# Altium schematic sheet BMS_3.SchDoc
size A0
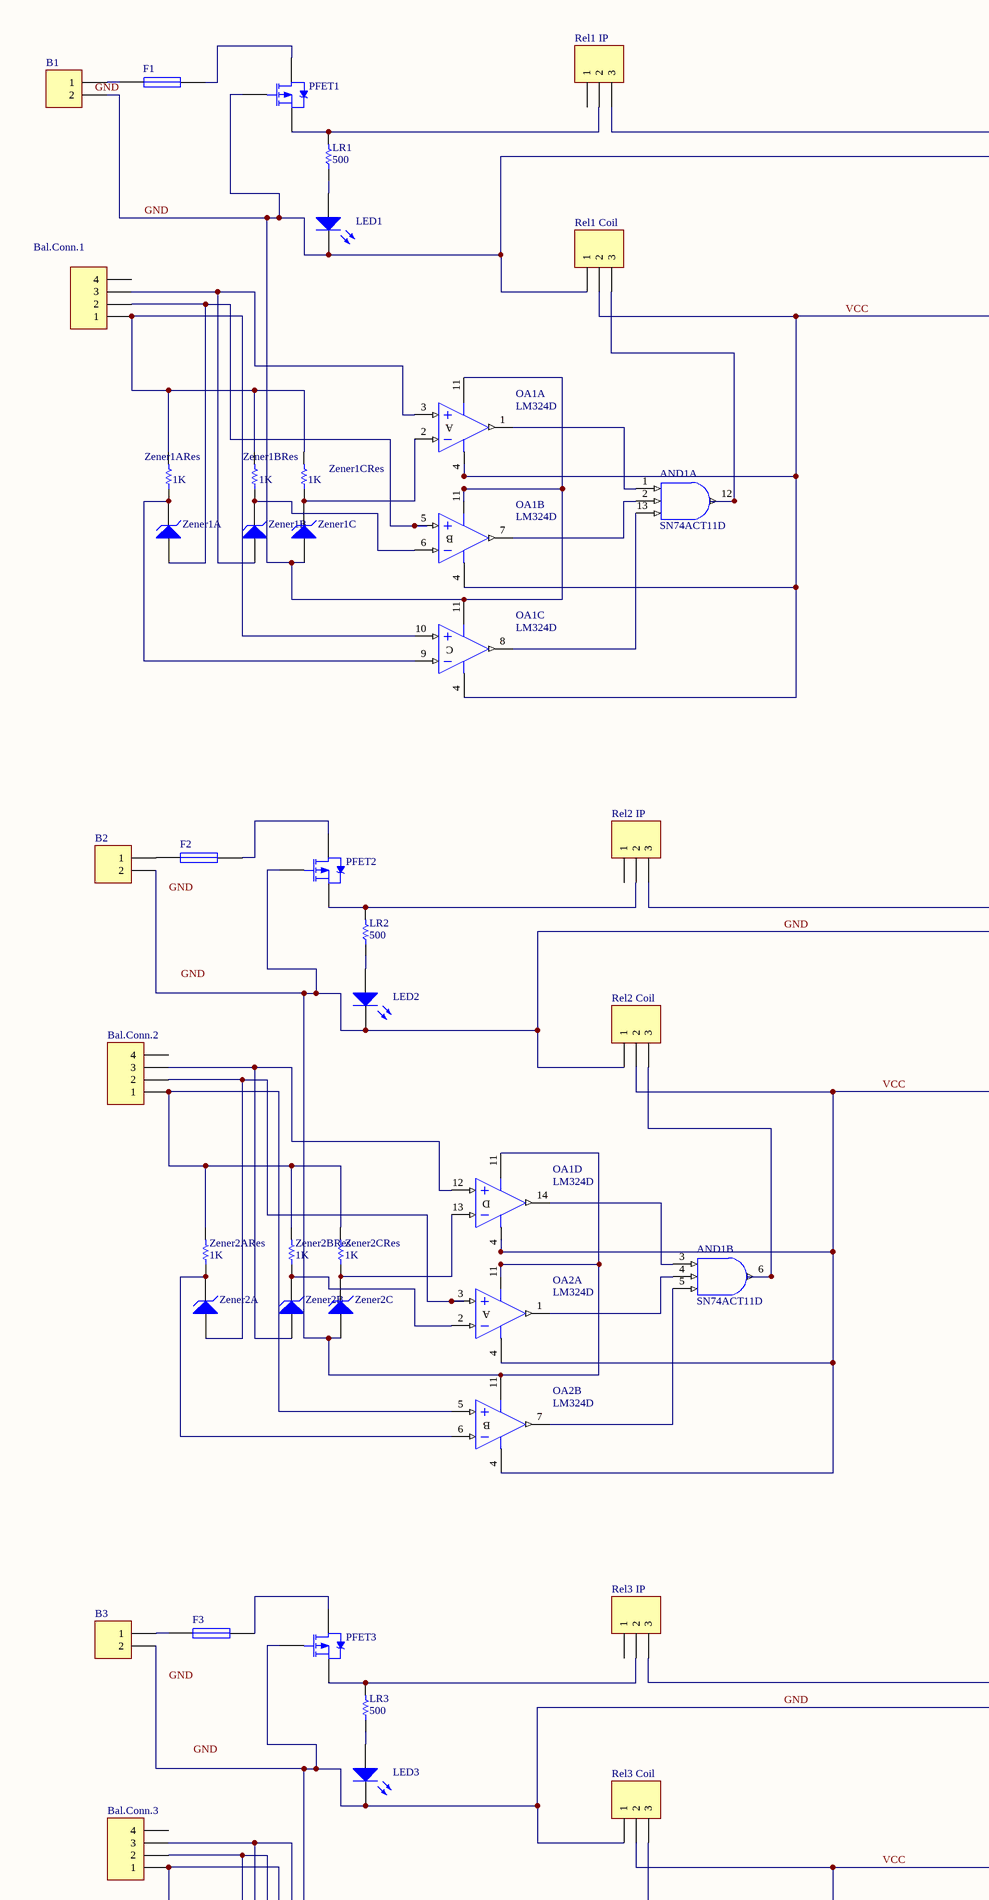
[diagram p0: BMS_3.SchDoc, top left]
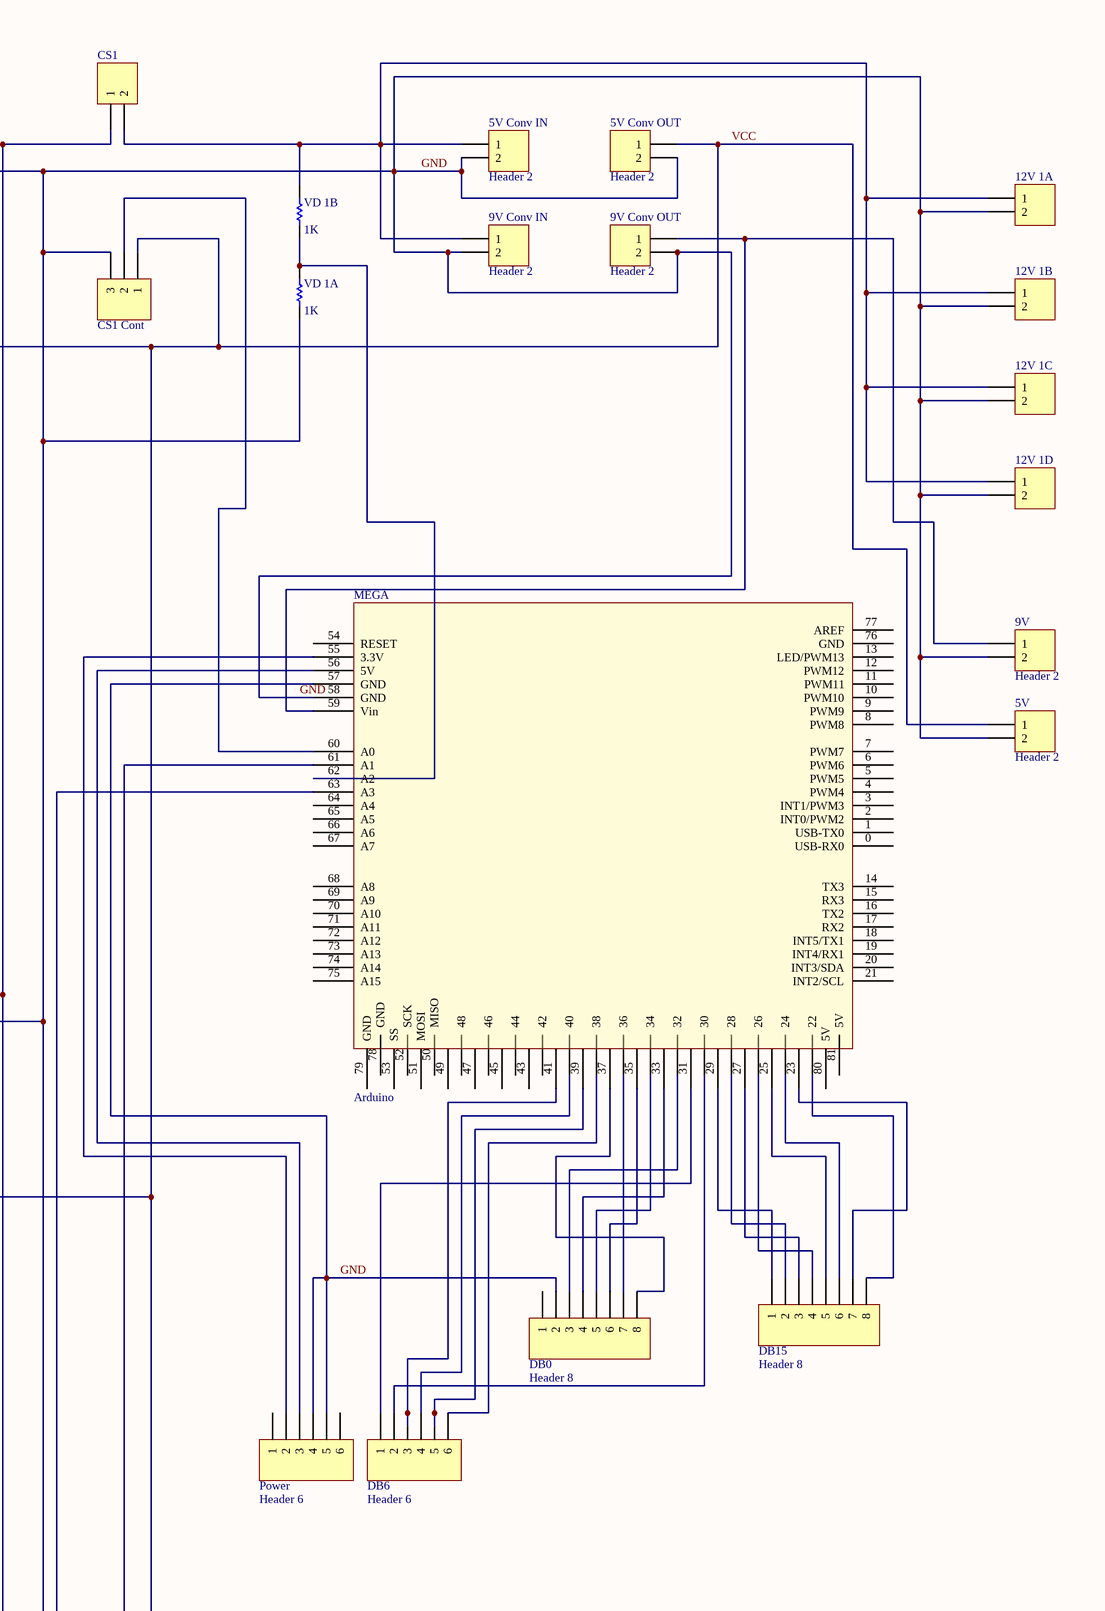
[diagram p1: BMS_3.SchDoc, top right]
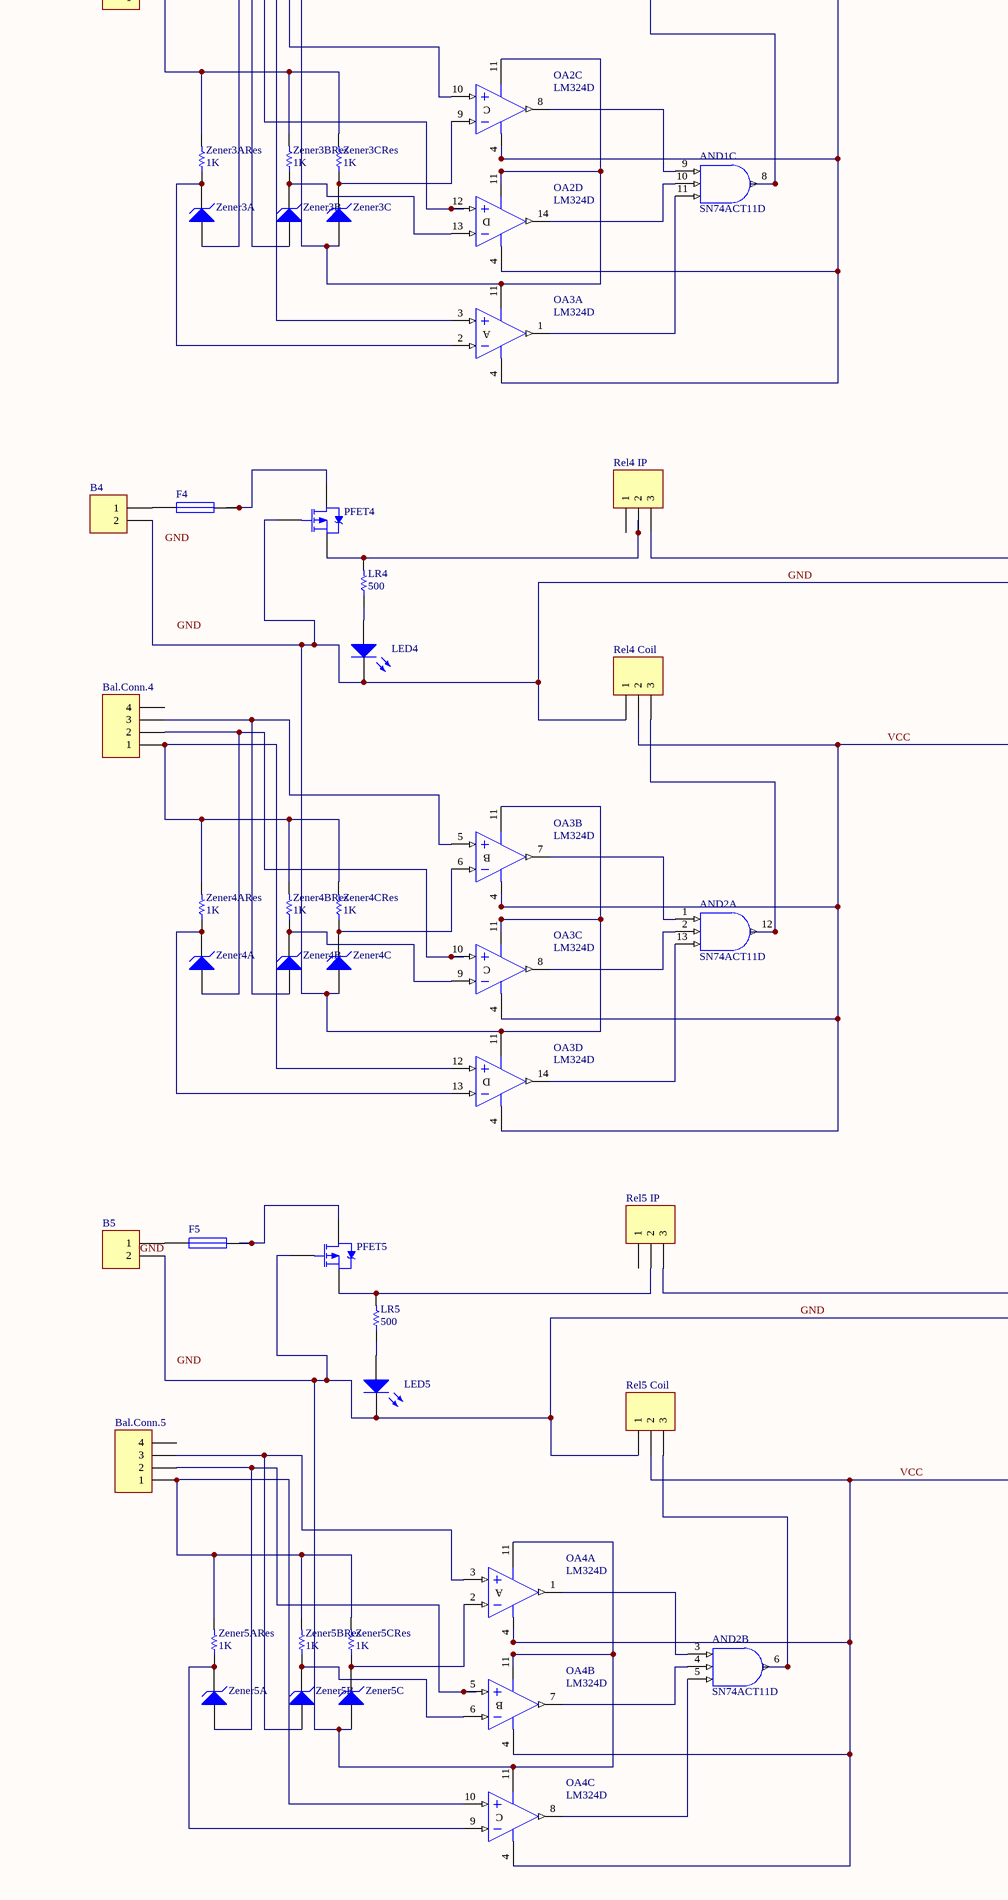
[diagram p2: BMS_3.SchDoc, bottom left]
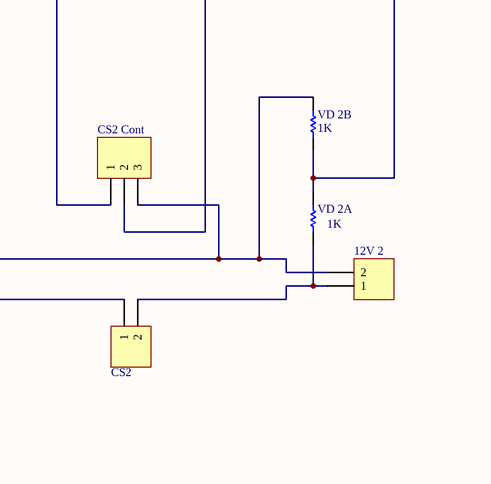
[diagram p3: BMS_3.SchDoc, bottom right]

## Parts
5V  Header 2  [HDR1X2]
5V_Conv_IN  Header 2  [HDR1X2]
5V_Conv_OUT  Header 2  [HDR1X2]
9V  Header 2  [HDR1X2]
9V_Conv_IN  Header 2  [HDR1X2]
9V_Conv_OUT  Header 2  [HDR1X2]
12V_1A  Header 2  [HDR1X2]  (value not drawn)
12V_1B  Header 2  [HDR1X2]  (value not drawn)
12V_1C  Header 2  [HDR1X2]  (value not drawn)
12V_1D  Header 2  [HDR1X2]  (value not drawn)
12V_2  12V supply  [HDR1X2]  (value not drawn)
AND1  SN74ACT11D  [N014]  (parts A,B,C of 3)
AND2  SN74ACT11D  [N014]  (parts A,B of 3)
B1  Header 2  [HDR1X2]  (value not drawn)
B2  Battery  [HDR1X2]  (value not drawn)
B3  Battery  [HDR1X2]  (value not drawn)
B4  Battery  [HDR1X2]  (value not drawn)
B5  Battery  [HDR1X2]  (value not drawn)
Bal.Conn.1  Balance Connector  [HDR1X4H]  (value not drawn)
Bal.Conn.2  Balance Connector  [HDR1X4H]  (value not drawn)
Bal.Conn.3  Balance Connector  [HDR1X4H]  (value not drawn)
Bal.Conn.4  Balance Connector  [HDR1X4H]  (value not drawn)
Bal.Conn.5  Balance Connector  [HDR1X4H]  (value not drawn)
CS1  Header 2  [HDR1X2]  (value not drawn)
CS1_Cont  Header 3H  [HDR1X3H]  (value not drawn)
CS2  Header 2  [HDR1X2]  (value not drawn)
CS2_Cont  Header 3H  [HDR1X3H]  (value not drawn)
DB0  Header 8  [HDR1X8]
DB6  Header 6  [HDR1X6]
DB15  Header 8  [HDR1X8]
F1  Fuse  [PIN-W2/E2.8]  (value not drawn)
F2  Fuse  [PIN-W2/E2.8]  (value not drawn)
F3  Fuse  [PIN-W2/E2.8]  (value not drawn)
F4  Fuse  [PIN-W2/E2.8]  (value not drawn)
F5  Fuse5  [PIN-W2/E2.8]  (value not drawn)
LED1  LED  [LED-0]  (value not drawn)
LED2  LED  [LED-0]  (value not drawn)
LED3  LED  [LED-0]  (value not drawn)
LED4  LED  [LED-0]  (value not drawn)
LED5  LED  [LED-0]  (value not drawn)
LR1  500  [AXIAL-0.3]
LR2  500  [AXIAL-0.3]
LR3  500  [AXIAL-0.3]
LR4  500  [AXIAL-0.3]
LR5  500  [AXIAL-0.3]
MEGA  Arduino  [Arduino]
OA1  LM324D  [N014]  (parts A,B,C,D of 4)
OA2  LM324D  [N014]  (parts A,B,C,D of 4)
OA3  LM324D  [N014]  (parts A,B,C,D of 4)
OA4  LM324D  [N014]  (parts A,B,C of 4)
PFET1  PMOS  [TO-220AB]  (value not drawn)
PFET2  PMOS  [TO-220AB]  (value not drawn)
PFET3  PMOS  [TO-220AB]  (value not drawn)
PFET4  PMOS  [TO-220AB]  (value not drawn)
PFET5  PMOS  [TO-220AB]  (value not drawn)
Power  Header 6  [HDR1X6]
Rel1_Coil  Relay coil  [HDR1X3H]  (value not drawn)
Rel1_IP  Relay  [HDR1X3H]  (value not drawn)
Rel2_Coil  Relay coil  [HDR1X3H]  (value not drawn)
Rel2_IP  Relay  [HDR1X3H]  (value not drawn)
Rel3_Coil  Relay coil  [HDR1X3H]  (value not drawn)
Rel3_IP  Relay  [HDR1X3H]  (value not drawn)
Rel4_Coil  Relay coil  [HDR1X3H]  (value not drawn)
Rel4_IP  Relay  [HDR1X3H]  (value not drawn)
Rel5_Coil  Relay coil  [HDR1X3H]  (value not drawn)
Rel5_IP  Relay  [HDR1X3H]  (value not drawn)
VD_1A  value 1K  [AXIAL-0.3]  (hidden comment: Res2)
VD_1B  value 1K  [AXIAL-0.3]  (hidden comment: Res1)
VD_2A  value 1K  [AXIAL-0.3]  (hidden comment: Res1)
VD_2B  value 1K  [AXIAL-0.3]  (hidden comment: Res1)
Zener1A  D Zener  [DIODE-0.4]  (value not drawn)
Zener1ARes  1K  [AXIAL-0.3]
Zener1B  D Zener  [DIODE-0.4]  (value not drawn)
Zener1BRes  1K  [AXIAL-0.3]
Zener1C  D Zener  [DIODE-0.4]  (value not drawn)
Zener1CRes  1K  [AXIAL-0.3]
Zener2A  D Zener  [DIODE-0.4]  (value not drawn)
Zener2ARes  1K  [AXIAL-0.3]
Zener2B  D Zener  [DIODE-0.4]  (value not drawn)
Zener2BRes  1K  [AXIAL-0.3]
Zener2C  D Zener  [DIODE-0.4]  (value not drawn)
Zener2CRes  1K  [AXIAL-0.3]
Zener3A  D Zener  [DIODE-0.4]  (value not drawn)
Zener3ARes  1K  [AXIAL-0.3]
Zener3B  D Zener  [DIODE-0.4]  (value not drawn)
Zener3BRes  1K  [AXIAL-0.3]
Zener3C  D Zener  [DIODE-0.4]  (value not drawn)
Zener3CRes  1K  [AXIAL-0.3]
Zener4A  D Zener  [DIODE-0.4]  (value not drawn)
Zener4ARes  1K  [AXIAL-0.3]
Zener4B  D Zener  [DIODE-0.4]  (value not drawn)
Zener4BRes  1K  [AXIAL-0.3]
Zener4C  D Zener  [DIODE-0.4]  (value not drawn)
Zener4CRes  1K  [AXIAL-0.3]
Zener5A  D Zener  [DIODE-0.4]  (value not drawn)
Zener5ARes  1K  [AXIAL-0.3]
Zener5B  D Zener  [DIODE-0.4]  (value not drawn)
Zener5BRes  1K  [AXIAL-0.3]
Zener5C  D Zener  [DIODE-0.4]  (value not drawn)
Zener5CRes  1K  [AXIAL-0.3]

## Nets
GND: 5V.2 5V_Conv_IN.2 5V_Conv_OUT.2 9V.2 9V_Conv_IN.2 9V_Conv_OUT.2 12V_1A.2 12V_1B.2 12V_1C.2 12V_1D.2 12V_2.2 AND1.7(GND) AND2.7(GND) B1.2 B2.2 B3.2 B4.2 B5.2 CS1_Cont.3 CS2_Cont.3 DB0.2 LED1.2(K) LED2.2(K) LED3.2(K) LED4.2(K) LED5.2(K) MEGA.57(GND) MEGA.58(GND) OA1.11(V-) OA2.11(V-) OA3.11(V-) OA4.11(V-) PFET1.1(G) PFET2.1(G) PFET3.1(G) PFET4.1(G) PFET5.1(G) Power.4 Power.5 Rel1_Coil.1 Rel2_Coil.1 Rel3_Coil.1 Rel4_Coil.1 Rel5_Coil.1 VD_1A.1 VD_2B.2 Zener1C.1(A) Zener2C.1(A) Zener3C.1(A) Zener4C.1(A) Zener5C.1(A)
VCC: 5V.1 5V_Conv_OUT.1 AND1.14(VCC) AND2.14(VCC) CS1_Cont.1 CS2_Cont.1 OA1.4(V+) OA2.4(V+) OA3.4(V+) OA4.4(V+) Rel1_Coil.2 Rel2_Coil.2 Rel3_Coil.2 Rel4_Coil.2 Rel5_Coil.2
Net5V_Conv_IN_1: 5V_Conv_IN.1 9V_Conv_IN.1 12V_1A.1 12V_1B.1 12V_1C.1 12V_1D.1 CS1.2 VD_1B.2
Net9V_1: 9V.1 9V_Conv_OUT.1 MEGA.59(Vin)
Net12V_2_1: 12V_2.1 CS2.2 VD_2A.1
NetAND1_1: AND1.1(A) OA1.1(OUT)
NetAND1_2: AND1.2(B) OA1.7(OUT)
NetAND1_3: AND1.3(A) OA1.14(OUT)
NetAND1_4: AND1.4(B) OA2.1(OUT)
NetAND1_5: AND1.5(C) OA2.7(OUT)
NetAND1_6: AND1.6(Y) Rel2_Coil.3
NetAND1_8: AND1.8(Y) Rel3_Coil.3
NetAND1_9: AND1.9(A) OA2.8(OUT)
NetAND1_10: AND1.10(B) OA2.14(OUT)
NetAND1_11: AND1.11(C) OA3.1(OUT)
NetAND1_12: AND1.12(Y) Rel1_Coil.3
NetAND1_13: AND1.13(C) OA1.8(OUT)
NetAND2_1: AND2.1(A) OA3.7(OUT)
NetAND2_2: AND2.2(B) OA3.8(OUT)
NetAND2_3: AND2.3(A) OA4.1(OUT)
NetAND2_4: AND2.4(B) OA4.7(OUT)
NetAND2_5: AND2.5(C) OA4.8(OUT)
NetAND2_6: AND2.6(Y) Rel5_Coil.3
NetAND2_12: AND2.12(Y) Rel4_Coil.3
NetAND2_13: AND2.13(C) OA3.14(OUT)
NetB1_1: B1.1 F1.2
NetB2_1: B2.1 F2.2
NetB3_1: B3.1 F3.2
NetB4_1: B4.1 F4.2
NetB5_1: B5.1 F5.2
NetBal.Conn.1_1: Bal.Conn.1.1 OA1.10(IN+) Zener1ARes.2 Zener1BRes.2 Zener1CRes.2
NetBal.Conn.1_2: Bal.Conn.1.2 OA1.5(IN+) Zener1A.1(A)
NetBal.Conn.1_3: Bal.Conn.1.3 OA1.3(IN+) Zener1B.1(A)
NetBal.Conn.2_1: Bal.Conn.2.1 OA2.5(IN+) Zener2ARes.2 Zener2BRes.2 Zener2CRes.2
NetBal.Conn.2_2: Bal.Conn.2.2 OA2.3(IN+) Zener2A.1(A)
NetBal.Conn.2_3: Bal.Conn.2.3 OA1.12(IN+) Zener2B.1(A)
NetBal.Conn.3_1: Bal.Conn.3.1 OA3.3(IN+) Zener3ARes.2 Zener3BRes.2 Zener3CRes.2
NetBal.Conn.3_2: Bal.Conn.3.2 OA2.12(IN+) Zener3A.1(A)
NetBal.Conn.3_3: Bal.Conn.3.3 OA2.10(IN+) Zener3B.1(A)
NetBal.Conn.4_1: Bal.Conn.4.1 OA3.12(IN+) Zener4ARes.2 Zener4BRes.2 Zener4CRes.2
NetBal.Conn.4_2: Bal.Conn.4.2 OA3.10(IN+) Zener4A.1(A)
NetBal.Conn.4_3: Bal.Conn.4.3 OA3.5(IN+) Zener4B.1(A)
NetBal.Conn.5_1: Bal.Conn.5.1 OA4.10(IN+) Zener5ARes.2 Zener5BRes.2 Zener5CRes.2
NetBal.Conn.5_2: Bal.Conn.5.2 OA4.5(IN+) Zener5A.1(A)
NetBal.Conn.5_3: Bal.Conn.5.3 OA4.3(IN+) Zener5B.1(A)
NetCS1_1: CS1.1 Rel1_IP.3 Rel2_IP.3 Rel3_IP.3
NetCS1_Cont_2: CS1_Cont.2 MEGA.60(A0)
NetCS2_1: CS2.1 Rel4_IP.3 Rel5_IP.3
NetCS2_Cont_2: CS2_Cont.2 MEGA.61(A1)
NetDB0_3: DB0.3 MEGA.32
NetDB0_4: DB0.4 MEGA.33
NetDB0_5: DB0.5 MEGA.34
NetDB0_6: DB0.6 MEGA.35
NetDB0_7: DB0.7 MEGA.36
NetDB0_8: DB0.8 MEGA.37
NetDB6_1: DB6.1 MEGA.31
NetDB6_2: DB6.2 MEGA.30
NetDB6_3: DB6.3 MEGA.41
NetDB6_4: DB6.4 MEGA.40
NetDB6_5: DB6.5 MEGA.39
NetDB6_6: DB6.6 MEGA.38
NetDB15_1: DB15.1 MEGA.29
NetDB15_2: DB15.2 MEGA.28
NetDB15_3: DB15.3 MEGA.27
NetDB15_4: DB15.4 MEGA.26
NetDB15_5: DB15.5 MEGA.25
NetDB15_6: DB15.6 MEGA.24
NetDB15_7: DB15.7 MEGA.23
NetDB15_8: DB15.8 MEGA.22
NetF1_1: F1.1 PFET1.2(D)
NetF2_1: F2.1 PFET2.2(D)
NetF3_1: F3.1 PFET3.2(D)
NetF4_1: F4.1 PFET4.2(D)
NetF5_1: F5.1 PFET5.2(D)
NetLED1_1: LED1.1(A) LR1.1
NetLED2_1: LED2.1(A) LR2.1
NetLED3_1: LED3.1(A) LR3.1
NetLED4_1: LED4.1(A) LR4.1
NetLED5_1: LED5.1(A) LR5.1
NetLR1_2: LR1.2 PFET1.3(S) Rel1_IP.2
NetLR2_2: LR2.2 PFET2.3(S) Rel2_IP.2
NetLR3_2: LR3.2 PFET3.3(S) Rel3_IP.2
NetLR4_2: LR4.2 PFET4.3(S) Rel4_IP.2
NetLR5_2: LR5.2 PFET5.3(S) Rel5_IP.2
NetMEGA_55: MEGA.55(3.3V) Power.2
NetMEGA_56: MEGA.56(5V) Power.3
NetMEGA_62: MEGA.62(A2) VD_1A.2 VD_1B.1
NetMEGA_63: MEGA.63(A3) VD_2A.2 VD_2B.1
NetOA1_2: OA1.2(IN-) Zener1C.2(K) Zener1CRes.1
NetOA1_6: OA1.6(IN-) Zener1B.2(K) Zener1BRes.1
NetOA1_9: OA1.9(IN-) Zener1A.2(K) Zener1ARes.1
NetOA1_13: OA1.13(IN-) Zener2C.2(K) Zener2CRes.1
NetOA2_2: OA2.2(IN-) Zener2B.2(K) Zener2BRes.1
NetOA2_6: OA2.6(IN-) Zener2A.2(K) Zener2ARes.1
NetOA2_9: OA2.9(IN-) Zener3C.2(K) Zener3CRes.1
NetOA2_13: OA2.13(IN-) Zener3B.2(K) Zener3BRes.1
NetOA3_2: OA3.2(IN-) Zener3A.2(K) Zener3ARes.1
NetOA3_6: OA3.6(IN-) Zener4C.2(K) Zener4CRes.1
NetOA3_9: OA3.9(IN-) Zener4B.2(K) Zener4BRes.1
NetOA3_13: OA3.13(IN-) Zener4A.2(K) Zener4ARes.1
NetOA4_2: OA4.2(IN-) Zener5C.2(K) Zener5CRes.1
NetOA4_6: OA4.6(IN-) Zener5B.2(K) Zener5BRes.1
NetOA4_9: OA4.9(IN-) Zener5A.2(K) Zener5ARes.1

Not connected (* = marked no-connect by the designer): Bal.Conn.1 4; Bal.Conn.2 4; Bal.Conn.3 4; Bal.Conn.4 4; Bal.Conn.5 4; DB0 1; MEGA 0(USB-RX0) 1(USB-TX0) 2(INT0/PWM2) 3(INT1/PWM3) 4(PWM4) 5(PWM5) 6(PWM6) 7(PWM7) 8(PWM8) 9(PWM9) 10(PWM10) 11(PWM11) 12(PWM12) 13(LED/PWM13) 14(TX3) 15(RX3) 16(TX2) 17(RX2) 18(INT5/TX1) 19(INT4/RX1) 20(INT3/SDA) 21(INT2/SCL) 42 43 44 45 46 47 48 49 50(MISO) 51(MOSI) 52(SCK) 53(SS) 54(RESET) 64(A4) 65(A5) 66(A6) 67(A7) 68(A8) 69(A9) 70(A10) 71(A11) 72(A12) 73(A13) 74(A14) 75(A15) 76(GND) 77(AREF) 78(GND) 79(GND) 80(5V) 81(5V); Power 1 6; Rel1_IP 1; Rel2_IP 1; Rel3_IP 1; Rel4_IP 1; Rel5_IP 1

## Notes on the sheet
- Labels drawn without touching a wire or pin: GND
- (in symbol LM324D, part A) A
- (in symbol LM324D, part B) B
- (in symbol LM324D, part C) C
- (in symbol LM324D, part D) D

## Library data of the parts
5V 5V_Conv_IN 5V_Conv_OUT 9V 9V_Conv_IN 9V_Conv_OUT 12V_1A 12V_1B 12V_1C 12V_1D 12V_2 B1-B5 CS1 CS2 = Header 2: Header, 2-Pin; LatestRevisionDate: 17-Jul-2002; LatestRevisionNote: Re-released for DXP Platform.; Publisher: Altium Limited
AND1 AND2 = SN74ACT11D: Triple 3-Input Positive-AND Gate; Published: 8-Jun-2000; LatestRevisionDate: 13-Apr-2006; LatestRevisionNote: IPC-7351 Footprint Added.; DatasheetVersion: Apr-1996; PackageVersion: Jan-1998; PackageReference: D014; Publisher: Altium Limited; PackageDescription: 14-Pin Small Outline Integrated Circuit 1.27 mm Pitch; Code_IPC: SOIC127P600-14; ComponentLink1Description: Manufacturer Link; ComponentLink1URL: http://www.ti.com/; ComponentLink2Description: Datasheet; ComponentLink2URL: http://www-s.ti.com/sc/ds/sn74act11.pdf; ComponentLink3Description: Packaging Specification; ComponentLink3URL: http://focus.ti.com/lit/ml/mpds177/mpds177.pdf
Bal.Conn.1-Bal.Conn.5 = Header 4H: Header, 4-Pin, Right Angle; LatestRevisionDate: 17-Jul-2002; LatestRevisionNote: Re-released for DXP Platform.; Publisher: Altium Limited
CS1_Cont CS2_Cont Rel1_Coil Rel1_IP Rel2_Coil Rel2_IP Rel3_Coil Rel3_IP Rel4_Coil Rel4_IP Rel5_Coil Rel5_IP = Header 3H: Header, 3-Pin, Right Angle; LatestRevisionDate: 17-Jul-2002; LatestRevisionNote: Re-released for DXP Platform.; Publisher: Altium Limited
DB0 DB15 = Header 8: Header, 8-Pin; LatestRevisionDate: 17-Jul-2002; LatestRevisionNote: Re-released for DXP Platform.; Publisher: Altium Limited
DB6 Power = Header 6: Header, 6-Pin; LatestRevisionDate: 17-Jul-2002; LatestRevisionNote: Re-released for DXP Platform.; Publisher: Altium Limited
F1-F4 = Fuse 1: Published: 8-Jun-2000; LatestRevisionDate: 17-Jul-2002; LatestRevisionNote: Re-released for DXP Platform.; PackageReference: PIN-W2/E2.8; Publisher: Altium Limited; PackageDescription: Thru-Hole; 2 Leads
F5 = Fuse 1: Fuse; Published: 8-Jun-2000; LatestRevisionDate: 17-Jul-2002; LatestRevisionNote: Re-released for DXP Platform.; PackageReference: PIN-W2/E2.8; Publisher: Altium Limited; PackageDescription: Thru-Hole; 2 Leads
LED1-LED5 = LED0: Typical INFRARED GaAs LED; Published: 8-Jun-2000; LatestRevisionDate: 08-Jul-2005; LatestRevisionNote: Mech Layer 1 removed.; PackageReference: LED-0; Publisher: Altium Limited; PackageDescription: LED; 2 Leads
LR1-LR5 VD_1A VD_1B VD_2A VD_2B Zener1ARes Zener1BRes Zener1CRes Zener2ARes Zener2BRes Zener2CRes Zener3ARes Zener3BRes Zener3CRes Zener4ARes Zener4BRes Zener4CRes Zener5ARes Zener5BRes Zener5CRes = Res1: Resistor; Published: 8-Jun-2000; LatestRevisionDate: 17-Jul-2002; LatestRevisionNote: Re-released for DXP Platform.; PackageReference: AXIAL-0.3; Publisher: Altium Limited; PackageDescription: Axial Device, Thru-Hole; 2 Leads; 0.3 in Pin Spacing
  LR1-LR5: Value: 500
  Zener1ARes Zener1BRes Zener1CRes Zener2ARes Zener2BRes Zener2CRes Zener3ARes Zener3BRes Zener3CRes Zener4ARes Zener4BRes Zener4CRes Zener5ARes Zener5BRes Zener5CRes: Value: 1K
OA1-OA4 = LM324D: Quadruple Operational Amplifier; Published: 16-Jan-2001; LatestRevisionDate: 13-Apr-2006; LatestRevisionNote: IPC-7351 Footprint Added.; DatasheetVersion: Feb-1997; PackageVersion: Jan-1998; PackageReference: D014; Publisher: Altium Limited; PackageDescription: 14-Pin Small Outline Integrated Circuit 1.27 mm Pitch; Code_IPC: SOIC127P600-14; ComponentLink1Description: Manufacturer Link; ComponentLink1URL: http://www.ti.com/; ComponentLink2Description: Datasheet; ComponentLink2URL: http://www-s.ti.com/sc/ds/lm324.pdf
PFET1-PFET5 = PMOS-2: P-Channel Power MOSFET; Note: Pin 4 not drawn and electrically connected to Pin 2.; Published: 8-Jun-2000; LatestRevisionDate: 17-Jul-2002; LatestRevisionNote: Re-released for DXP Platform.; DatasheetVersion: PD-9.390D; PackageVersion: Feb-1997; PackageReference: TO-220AB; Publisher: Altium Limited; PackageDescription: TO, Thru-Hole, Vertical, Heatsink Mounted; 3 In-Line Leads; Pitch 2.54 mm; ComponentLink1Description: Manufacturer Link; ComponentLink1URL: http://www.irf.com/
Zener1A Zener1B Zener1C Zener2A Zener2B Zener2C Zener3A Zener3B Zener3C Zener4A Zener4B Zener4C Zener5A Zener5B Zener5C = D Zener: Zener Diode; Published: 8-Jun-2000; LatestRevisionDate: 17-Jul-2002; LatestRevisionNote: Re-released for DXP Platform.; PackageReference: DIODE-0.7; Publisher: Altium Limited; PackageDescription: Diode, Thru-Hole; 2 Leads; 0.7 in Pin Spacing